# EAGLE design Solar Lantern (EAGLE 9.0.0)
CNAME: ALICAD; CREVISION: V1.2; DESIGNER: Alan Ibbett
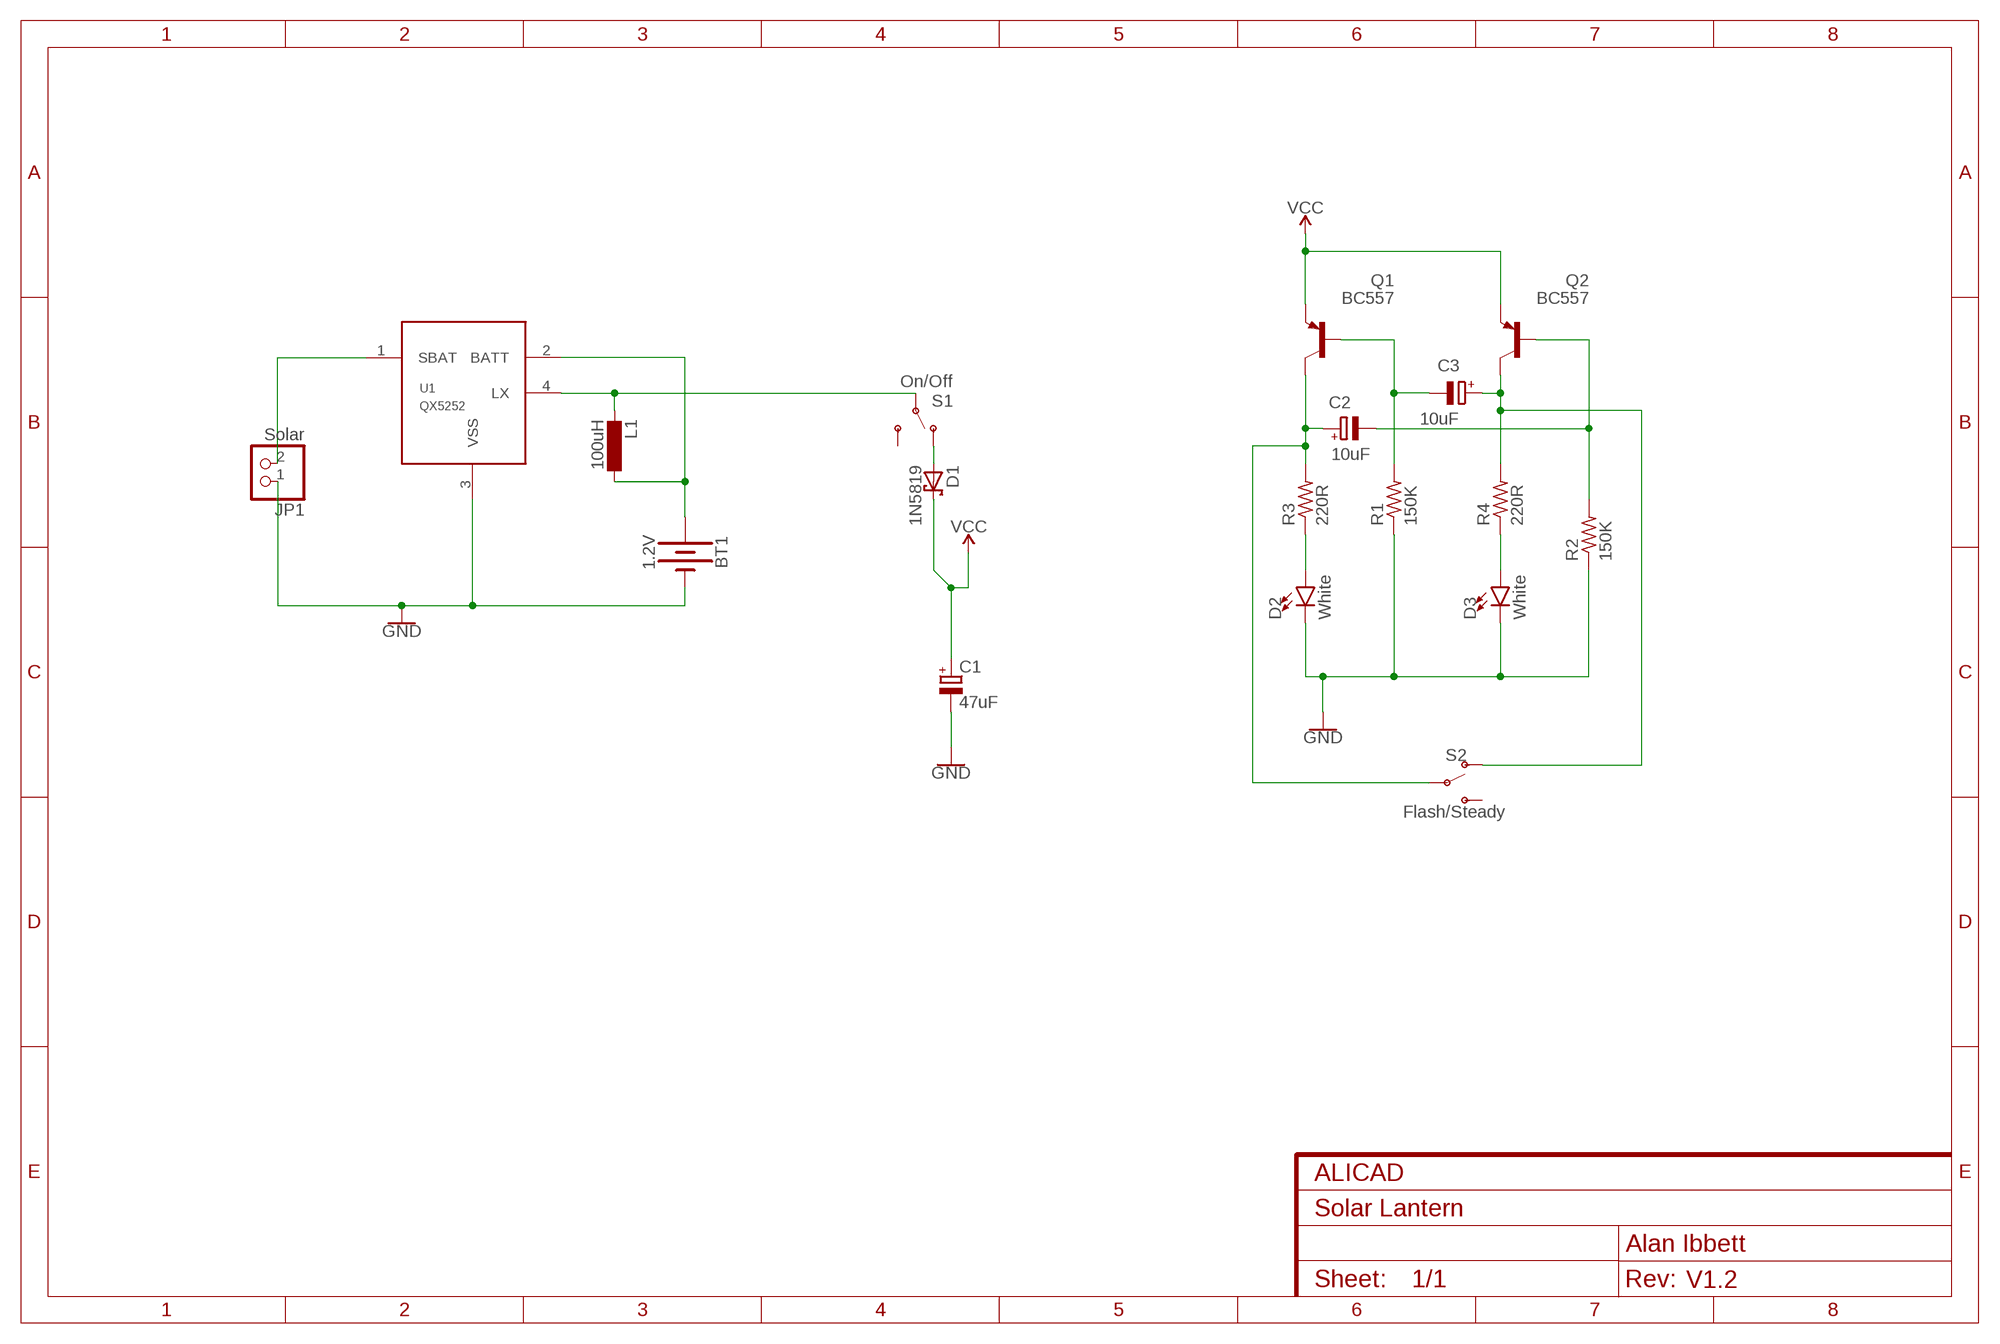
[diagram p0: schematic, sheet 1]

## Parts
BT1  1.2V  BATTERY-AA  [BATTERY-AA]
C1  47uF  CPOL-EUE3.5-8  [E3,5-8]
C2  10uF  CPOL-EUE2.5-7  [E2,5-7]
C3  10uF  CPOL-EUE2.5-7  [E2,5-7]
D1  1N5819  SCHOTTKY-DIODEDO35-7  [DO35-7]
D2  White  LED5MM  [LED_5MM]
D3  White  LED5MM  [LED_5MM]
JP1  Solar  PINHD-1X2  [1X02]
L1  100uH  L-EU0207/10  [0207/10]
Q1  BC557  [TO92]
Q2  BC557  [TO92]
R1  150K  R-US_0207/10  [0207/10]
R2  150K  R-US_0207/10  [0207/10]
R3  220R  R-US_0207/10  [0207/10]
R4  220R  R-US_0207/10  [0207/10]
S1  On/Off  SWITCH-SPDT-PTH-11.6X4.0MM  [SWITCH_SPDT_PTH_11.6X4.0MM]
S2  Flash/Steady  SWITCH-SPDT-PTH-11.6X4.0MM  [SWITCH_SPDT_PTH_11.6X4.0MM]
U1  QX5252  [TO94]

## Nets
GND: BT1.GND@1(-) C1.- D2.K(C) D3.K(C) JP1.1 R1.1 R2.1 U1.3(VSS)
N$1: C3.- Q1.2(B) R1.2
N$2: C2.- Q2.2(B) R2.2
N$3: C3.+ Q2.3(C) R4.2 S2.1(O)
N$4: D3.A R4.1
N$5: C2.+ Q1.3(C) R3.2 S2.2(P)
N$6: D2.A R3.1
N$10: JP1.2 U1.1(SBAT)
N$12: L1.2 S1.2(P) U1.4(LX)
N$13: BT1.PWR@1(+) L1.1 U1.2(BATT)
N$14: D1.A S1.1(O)
VCC: C1.+ D1.C Q1.1(E) Q2.1(E)
Unconnected: S1.3(S) S2.3(S)

## Library data of the parts
BT1 = SparkFun-Batteries:BATTERY: Battery - Single Cell A variety of battery chemistries, sizes, and footprints. Device List: 20MM_PTH - Coin Cell Battery Holder - 20mm (PTH) <https://www.sparkfun.com/products/783> 6.8MM_PTH - Coin Cell Battery Holder - 6.8MM(SMD) <https://www.digikey.com/product-detail/en/seiko-instruments/MS621FE-FL11E/728-1057-ND/1889208?WT.srch=1&gclid=CNOQ5a6LzdQCFZS2wAodXCkE0g> 12MM_SMD - Coin Cell Battery Holder - 12mm (SMD) <https://www.sparkfun.com/products/10592> 12MM_PTH - Coin Cell Battery Holder - 12mm (PTH) <https://www.sparkfun.com/products/7948> 20MM_SMD - 20mm Coin Cell Battery Holder (SMD) (2 legs) Used on the Big Time Watch Kit <https://www.sparkfun.com/products/11734> 20MM_SMD_4LEGS - Coin Cell Battery Holder - 20mm (SMD) <https://www.sparkfun.com/products/11892> 20MM_SMD_4LEGS_OVERPASTE - Coin Cell Battery Holder - 20mm (SMD) <https://www.sparkfun.com/products/11892> (Over-paste on the legs) 24.5MM_PTH - Coin Cell Battery Holder - 24.5mm (PTH) <https://www.sparkfun.com/products/8863> 9V - 9V Battery Holder - PC Mount Used on the SparkFun SparkPunk Sound Kit <https://www.sparkfun.com/products/11177> and SparkFun SparkPunk Sequencer Kit <https://www.sparkfun.com/products/12707> 18650 - Battery Holder - 18650 (PTH) <https://www.sparkfun.com/products/13113> AA - Battery Holder - 1xAA (PTH) <https://www.sparkfun.com/products/7949> AAA - Battery Holder - 1xAAA (PTH) <https://www.sparkfun.com/products/12718> AA_KIT - Battery Holder - 1xAA (PTH) <https://www.sparkfun.com/products/7949> Special kit package - pads only have exposed copper on one side of the board. AAA_KIT - Battery Holder - 1xAAA (PTH) <https://www.sparkfun.com/products/12718> Special kit package - pads only have exposed copper on one side of the board.; PROD_ID: BATT-08316; SF_SKU: PRT-07949
C1-C3 = rcl:CPOL-EU: POLARIZED CAPACITOR, European symbol; SPICEPREFIX: C
D1 = diode:SCHOTTKY-DIODE: Schottky Diode
D2 D3 = SparkFun-LED:LED: LED (Generic) Standard schematic elements and footprints for 5mm, 3mm, 1206, and 0603 sized LEDs. Generic LEDs with no color specified.
JP1 = DC_LOAD_AU:PINHD-1X2: PIN HEADER
L1 = resistor:L-EU: INDUCTOR, European symbol
Q1 Q2 = transistor-pnp:BC557: PNP Transistor
R1-R4 = rcl:R-US_: RESISTOR, American symbol; SPICEPREFIX: R
S1 S2 = SparkFun-Switches:SWITCH-SPDT: Single Pole, Double Throw (SPDT) Switch Single-pole, double-throw (SPDT) switch. Variant Overview SMD-AYZ0202 Surface Mount DPDT Switch <https://www.sparkfun.com/products/597> (COM-00597) Used on e.g. LilyPad Arduino USB - ATmega32U4 Board <https://www.sparkfun.com/products/12049> PTH-11.6X4.0MM SPDT Mini Power Switch <https://www.sparkfun.com/products/102> (COM-00102) Used on e.g. SparkFun Simon Says - Through-Hole Soldering Kit <https://www.sparkfun.com/products/10547> (KIT-10547) PTH-11.6X4.0MM-KIT KIT version of SPDT Mini Power Switch - Simplifies soldering by removing tStop of switch pins - only one side can be soldered. PTH-11.6X4.0MM-LOCK LOCK version of SPDT Mini Power Switch - Offset pins hold switch in place for easier soldering. SMD-RIGHT-ANGLE Surface Mount Right Angle Switch <https://www.sparkfun.com/products/10860> (COM-10860) Used on e.g. SparkFun ESP8266 Thing <https://www.sparkfun.com/products/13231>; PROD_ID: SWCH-08261; SF_SKU: COM-00102
U1 = Alicad:QX5252: QX5252 QX5252 is an ASIC (application­specific integrated circuit) designed specifically for solar­powered LED lighting installations. It is composed of a switch­driven circuit, light control circuit, UVLO (under voltage lock­out) circuit, an internally integrated Schottky diode tube and other circuits. QX5252 only needs to be connected to an external inductor to make up a solar­powered lighting installation. The input voltage for QX5252 is 0.9 ­ 1.5V, which is most suitably powered by single­cell AA batteries or single­cell NiMH (nickel metal hydride) batteries. Its advantages include low energy expenditure and high efficiency. QX5252 uses patent technology, which stops LED scintillation pulsing during under voltage shutdown, and is suitable for the application of low power single dry battery cell lawn lighting.

## Board
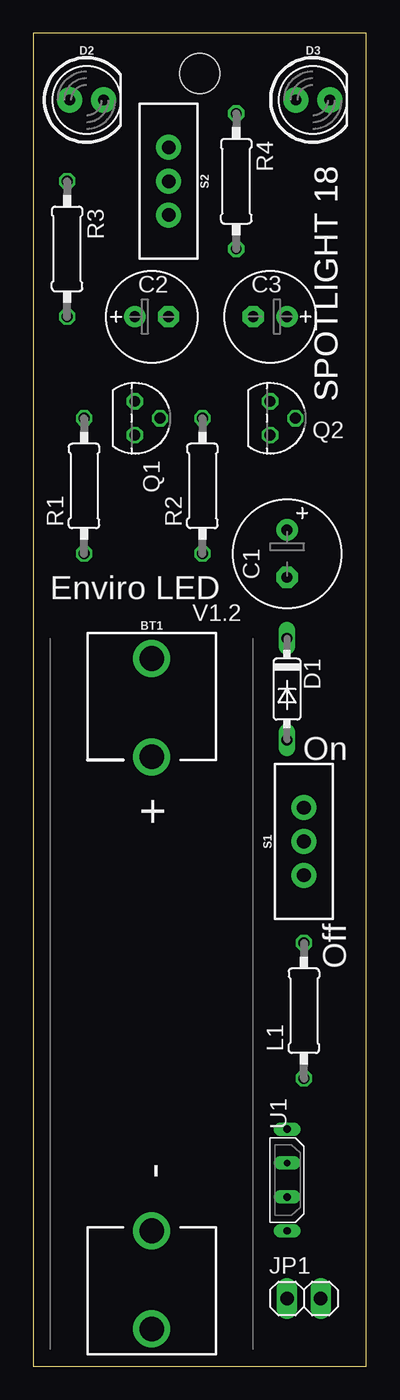
[diagram p1: board, top side]
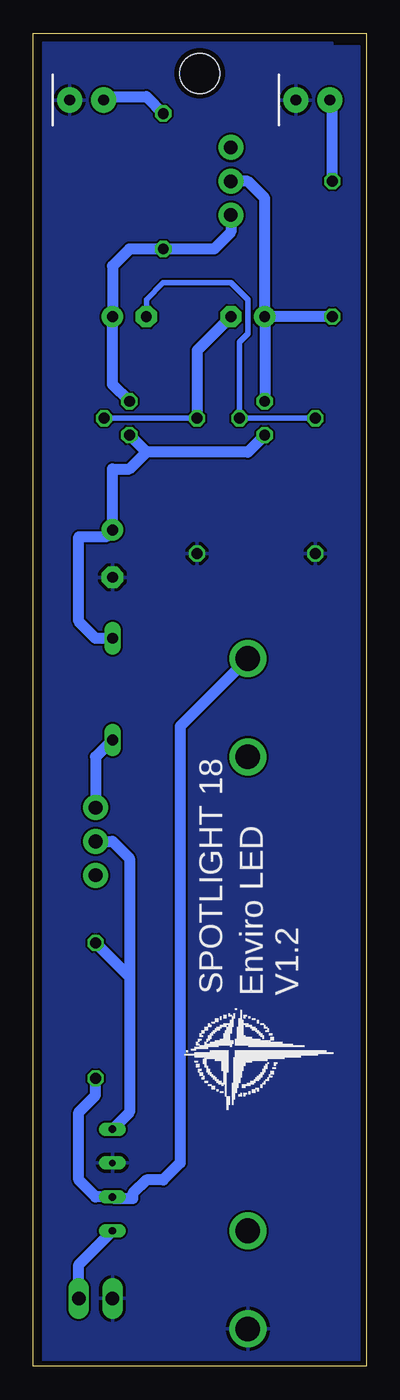
[diagram p2: board, bottom side, seen from below]

Size 25 x 100 mm. Coordinates in mm from the lower left corner, seen from the top.
Outline: 0,0 25,0 25,100 0,100 0,0
Copper layers (1*16): Top 0.0356mm / dielectric 1.5011mm / Bottom 0.0356mm
Design rules "oshpark-2layer": minimum track width 6mil, minimum drill 13mil, track to track 6mil, track to pad 6mil, pad to pad 6mil, via to via 6mil, smd to smd 6mil, copper to edge 15mil, drill to drill 6mil, minimum pad ring 7mil, minimum via ring 7mil, stop-mask expansion 2.5mil, vias tented up to drill 0mil, thermal gap 10mil
Holes 3 mm at 12.5,97

### Footprints (pad centres in the part's own frame; a part is rotated, then mirrored left to right if it is on the bottom)
BATTERY-AA = drill 1.854: GND@1 25.146,0; GND@2 17.78,0; PWR@1 -25.146,0; PWR@2 -17.78,0
E3,5-8 = drill 0.813 pad 1.6: + -1.778,0 | drill 0.813 pad 1.6 octagon: - 1.778,0
E2,5-7 = drill 0.813 pad 1.6: + -1.27,0 | drill 0.813 pad 1.6 octagon: - 1.27,0
DO35-7 = drill 0.813 long: A 3.81,0; C -3.81,0
LED_5MM = drill 0.813 pad 1.88: A -1.27,0; K 1.27,0
1X02 = drill 1.016 long: 1 -1.27,0; 2 1.27,0
0207/10 = drill 0.813 octagon: 1 -5.08,0; 2 5.08,0
TO92 = drill 0.813 octagon: 1 1.27,0; 2 0,1.905; 3 -1.27,0
SWITCH_SPDT_PTH_11.6X4.0MM = drill 1.016 pad 1.88: 1 0,2.54; 2 0,0; 3 0,-2.54
TO94 = drill 0.55 pad 1.016 long: 1 -3.81,0; 2 -1.27,0; 4 3.81,0 | drill 0.5 pad 1.016 long: 3 1.27,0

### Placement (x,y rotation side)
BT1  8.89,27.94 270 top
C1  19.05,60.96 270 top
C2  8.89,78.74 0 top
C3  17.78,78.74 180 top
D1  19.05,50.8 270 top
D2  4,95 0 top
D3  21,95 0 top
JP1  20.32,5.08 0 top
L1  20.32,26.67 90 top
Q1  7.62,71.12 270 top
Q2  17.78,71.12 270 top
R1  3.81,66.04 90 top
R2  12.7,66.04 90 top
R3  2.54,83.82 270 top
R4  15.24,88.9 270 top
S1  20.32,39.37 0 top
S2  10.16,88.9 180 top
U1  19.05,13.97 90 top

### Tracks (layer width: path | path; a pad name or v marks a point on that pad's centre or on a via)
GND
  pour Bottom: 0.51,99.06 0.51,0.38 1.65,0.38 24.26,0.38 24.26,0.64 24.26,99.31 4.7,99.31 2.54,99.31 2.54,99.06
N$1
  Bottom 0.406: R1.2 Q1.2 9.53,76.83 8.89,77.47 8.89,80.01 10.16,81.28 15.24,81.28 16.51,80.01 C3.-
N$2
  Bottom 0.406: R2.2 Q2.2
  Bottom 0.813: C2.- 12.7,76.2 R2.2
N$3
  Bottom 0.813: S2.1 10.16,85.09 11.43,83.82 R4.2 17.78,83.82 19.05,82.55 C3.+ 19.05,73.66 Q2.3
N$4
  Bottom 0.813: D3.A 19.73,95.25 16.51,95.25 R4.1
N$5
  Bottom 0.813: R3.2 C2.+ | S2.2 8.89,88.9 7.62,87.63 C2.+ | C2.+ Q1.3
N$6
  Bottom 0.254: 2.54,95 D2.A
  Bottom 0.813: R3.1 2.54,95
N$10
  Bottom 0.813: JP1.2 21.59,7.62 U1.1
N$12
  Bottom 0.813: 17.78,29.21 17.78,19.05 U1.4 | 17.78,29.21 L1.2 | S1.2 19.05,39.37 17.78,38.1 17.78,29.21
N$13
  Bottom 0.813: L1.1 20.32,20.32 21.59,19.05 21.59,13.97 20.32,12.7 U1.2 18.92,12.57 17.53,12.57 17.53,12.95 16.51,13.97 15.24,13.97 13.97,15.24 13.97,48.01 BT1.PWR@1
N$14
  Bottom 0.813: D1.A 20.32,45.72 S1.1
VCC
  Bottom 0.813: Q1.1 8.89,68.58 16.51,68.58 | 16.51,68.58 Q2.1 | 16.51,68.58 17.78,67.31 19.05,67.31 C1.+ 19.56,62.23 21.59,62.23 21.59,55.88 20.32,54.61 D1.C

### Text on the board
tPlace: SPOTLIGHT 18 | SPOTLIGHT 18 | Enviro LED | V1.2 | On | Off
bPlace: Enviro LED / V1.2 | SPOTLIGHT 18